# EAGLE design schematic (EAGLE 9.6.2)
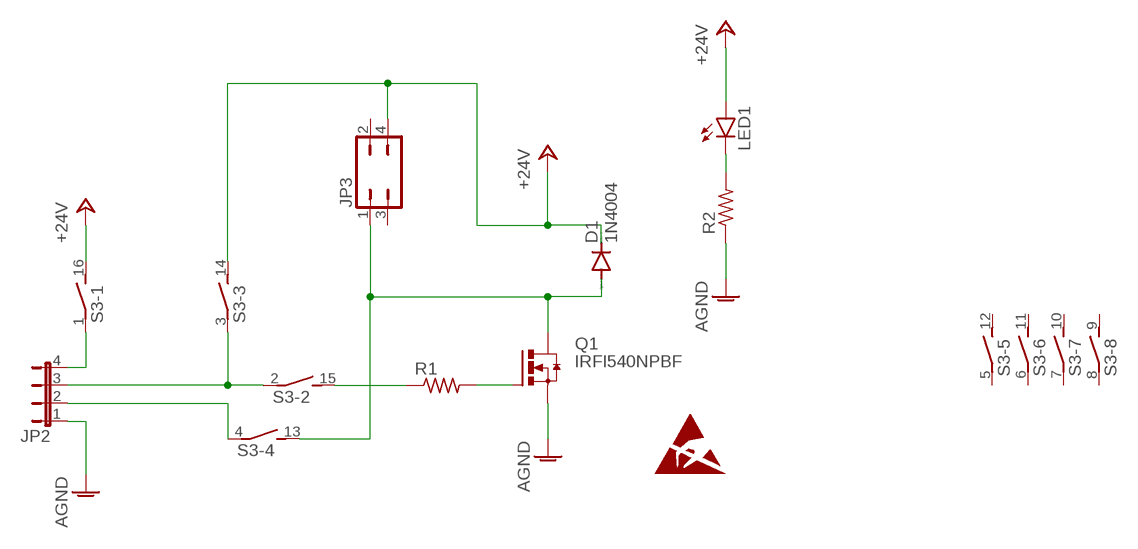
[diagram p0: schematic, sheet 1]

## Parts
D1  1N4004  [DO41-10]
JP2  JP4E  [JP4]
JP3  JP2Q  [JP2Q]
LED1  LED3MM  [LED3MM]
Q1  IRFI540NPBF  [TO220BH]
R1  R-US_M0805  [M0805]
R2  R-US_0411/15  [0411/15]
S3  DIP08S  [DIP08S]

## Nets
+24V: D1.C JP3.4 LED1.A S3.14 S3.16
AGND: JP2.1 Q1.S R2.1
N$1: Q1.G R1.2
N$2: D1.A JP3.1 Q1.D S3.13
N$3: JP2.3 S3.2 S3.3
N$4: JP2.4 S3.1
N$5: R1.1 S3.15
N$6: JP2.2 S3.4
N$7: LED1.K(C) R2.2
Unconnected: JP3.2 JP3.3 S3.5 S3.6 S3.7 S3.8 S3.9 S3.10 S3.11 S3.12

## Library data of the parts
D1 = diode:1N4004: DIODE general purpose rectifier, 1 A
JP2 = jumper:JP4E: JUMPER
JP3 = jumper:JP2Q: JUMPER
LED1 = led:LED: LED OSRAM: - CHIPLED LG R971, LG N971, LY N971, LG Q971, LY Q971, LO R971, LY R971 LH N974, LH R974 LS Q976, LO Q976, LY Q976 LO Q996 - Hyper CHIPLED LW Q18S LB Q993, LB Q99A, LB R99A - SideLED LS A670, LO A670, LY A670, LG A670, LP A670 LB A673, LV A673, LT A673, LW A673 LH A674 LY A675 LS A676, LA A676, LO A676, LY A676, LW A676 LS A679, LY A679, LG A679 - Hyper Micro SIDELED® LS Y876, LA Y876, LO Y876, LY Y876 LT Y87S - SmartLED LW L88C, LW L88S LB L89C, LB L89S, LG L890 LS L89K, LO L89K, LY L89K LS L896, LA L896, LO L896, LY L896 - TOPLED LS T670, LO T670, LY T670, LG T670, LP T670 LSG T670, LSP T670, LSY T670, LOP T670, LYG T670 LG T671, LOG T671, LSG T671 LB T673, LV T673, LT T673, LW T673 LH T674 LS T676, LA T676, LO T676, LY T676, LB T676, LH T676, LSB T676, LW T676 LB T67C, LV T67C, LT T67C, LS T67K, LO T67K, LY T67K, LW E67C LS E67B, LA E67B, LO E67B, LY E67B, LB E67C, LV E67C, LT E67C LW T67C LS T679, LY T679, LG T679 LS T770, LO T770, LY T770, LG T770, LP T770 LB T773, LV T773, LT T773, LW T773 LH T774 LS E675, LA E675, LY E675, LS T675 LS T776, LA T776, LO T776, LY T776, LB T776 LHGB T686 LT T68C, LB T68C - Hyper Mini TOPLED® LB M676 - Mini TOPLED Santana® LG M470 LS M47K, LO M47K, LY M47K Source: http://www.osram.convergy.de LUXEON: - LUMILED® LXK2-PW12-R00, LXK2-PW12-S00, LXK2-PW14-U00, LXK2-PW14-V00 LXK2-PM12-R00, LXK2-PM12-S00, LXK2-PM14-U00 LXK2-PE12-Q00, LXK2-PE12-R00, LXK2-PE12-S00, LXK2-PE14-T00, LXK2-PE14-U00 LXK2-PB12-K00, LXK2-PB12-L00, LXK2-PB12-M00, LXK2-PB14-N00, LXK2-PB14-P00, LXK2-PB14-Q00 LXK2-PR12-L00, LXK2-PR12-M00, LXK2-PR14-Q00, LXK2-PR14-R00 LXK2-PD12-Q00, LXK2-PD12-R00, LXK2-PD12-S00 LXK2-PH12-R00, LXK2-PH12-S00 LXK2-PL12-P00, LXK2-PL12-Q00, LXK2-PL12-R00 Source: www.luxeon.com KINGBRIGHT: KA-3528ASYC Source: www.kingbright.com
Q1 = transistor-power:IRFI540NPBF: HEXFET Power MOISFET VDSS = 100V, RDS(on) = 0.052 Ohm, ID = 20A, VGS(th) = 2.0 -- 4.0V Source: http://www.irf.com/product-info/datasheets/data/irfi540npbf.pdf
R1 R2 = rcl:R-US_: RESISTOR, American symbol; SPICEPREFIX: R
S3 = switch-dil:DIP08S: DIL/CODE SWITCH; OC_FARNELL: unknown; OC_NEWARK: unknown

## Board
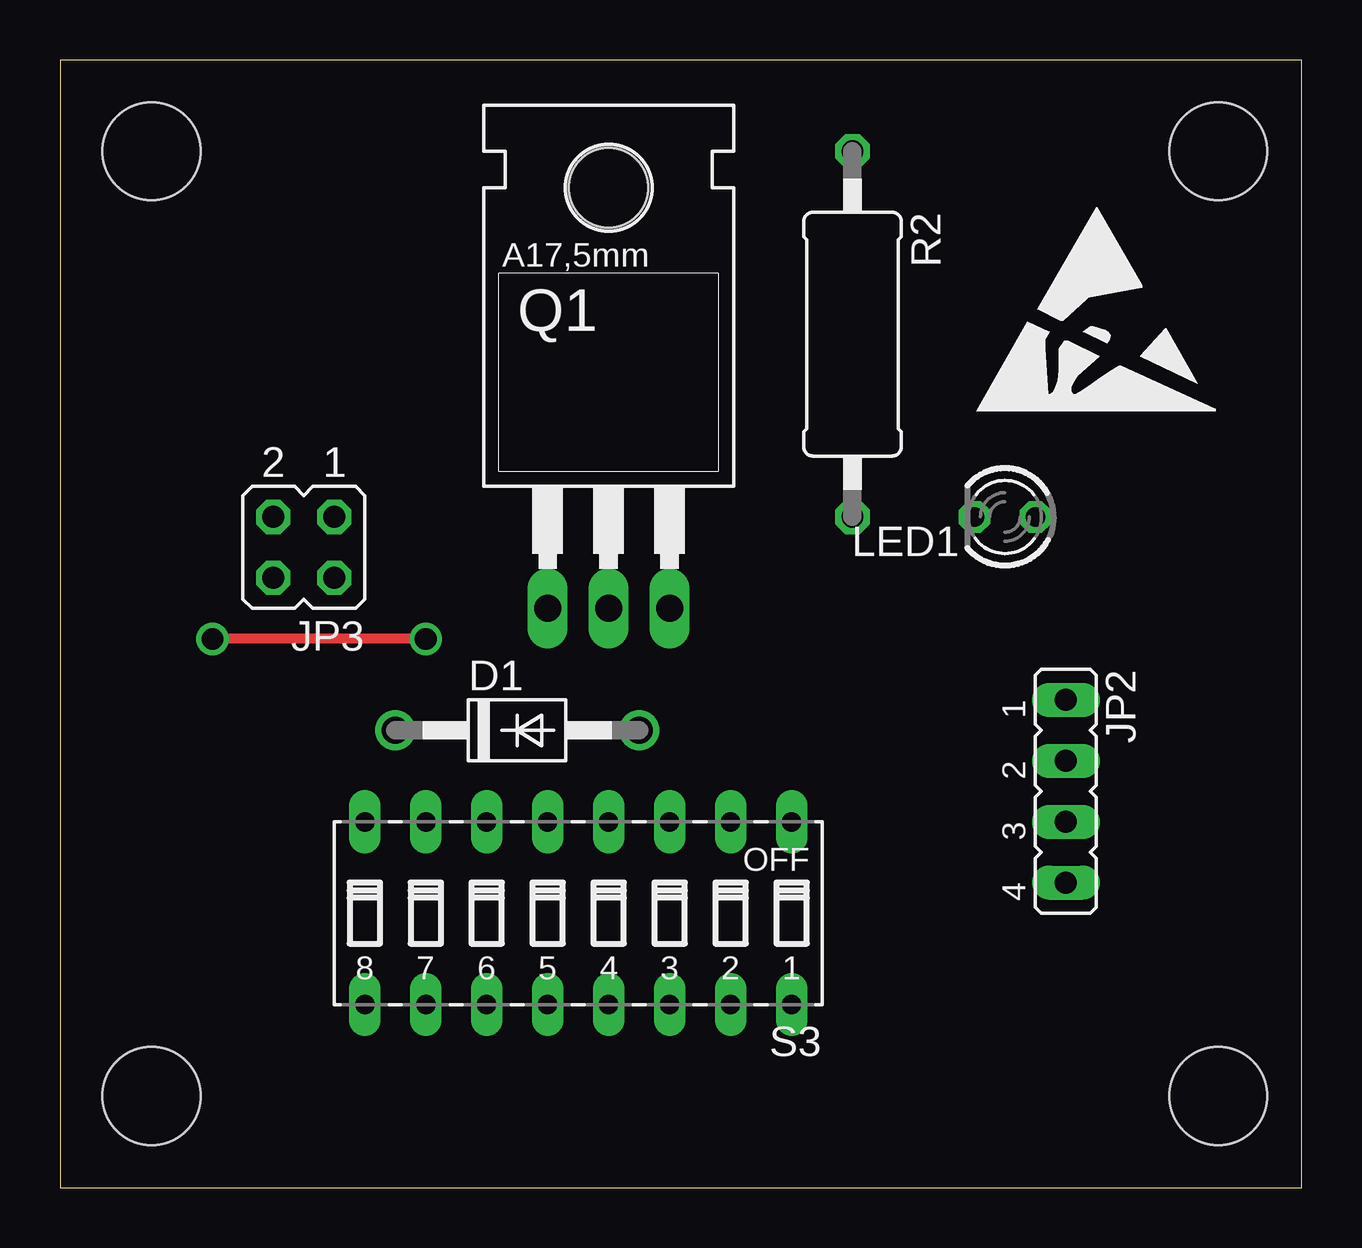
[diagram p1: board, top side]
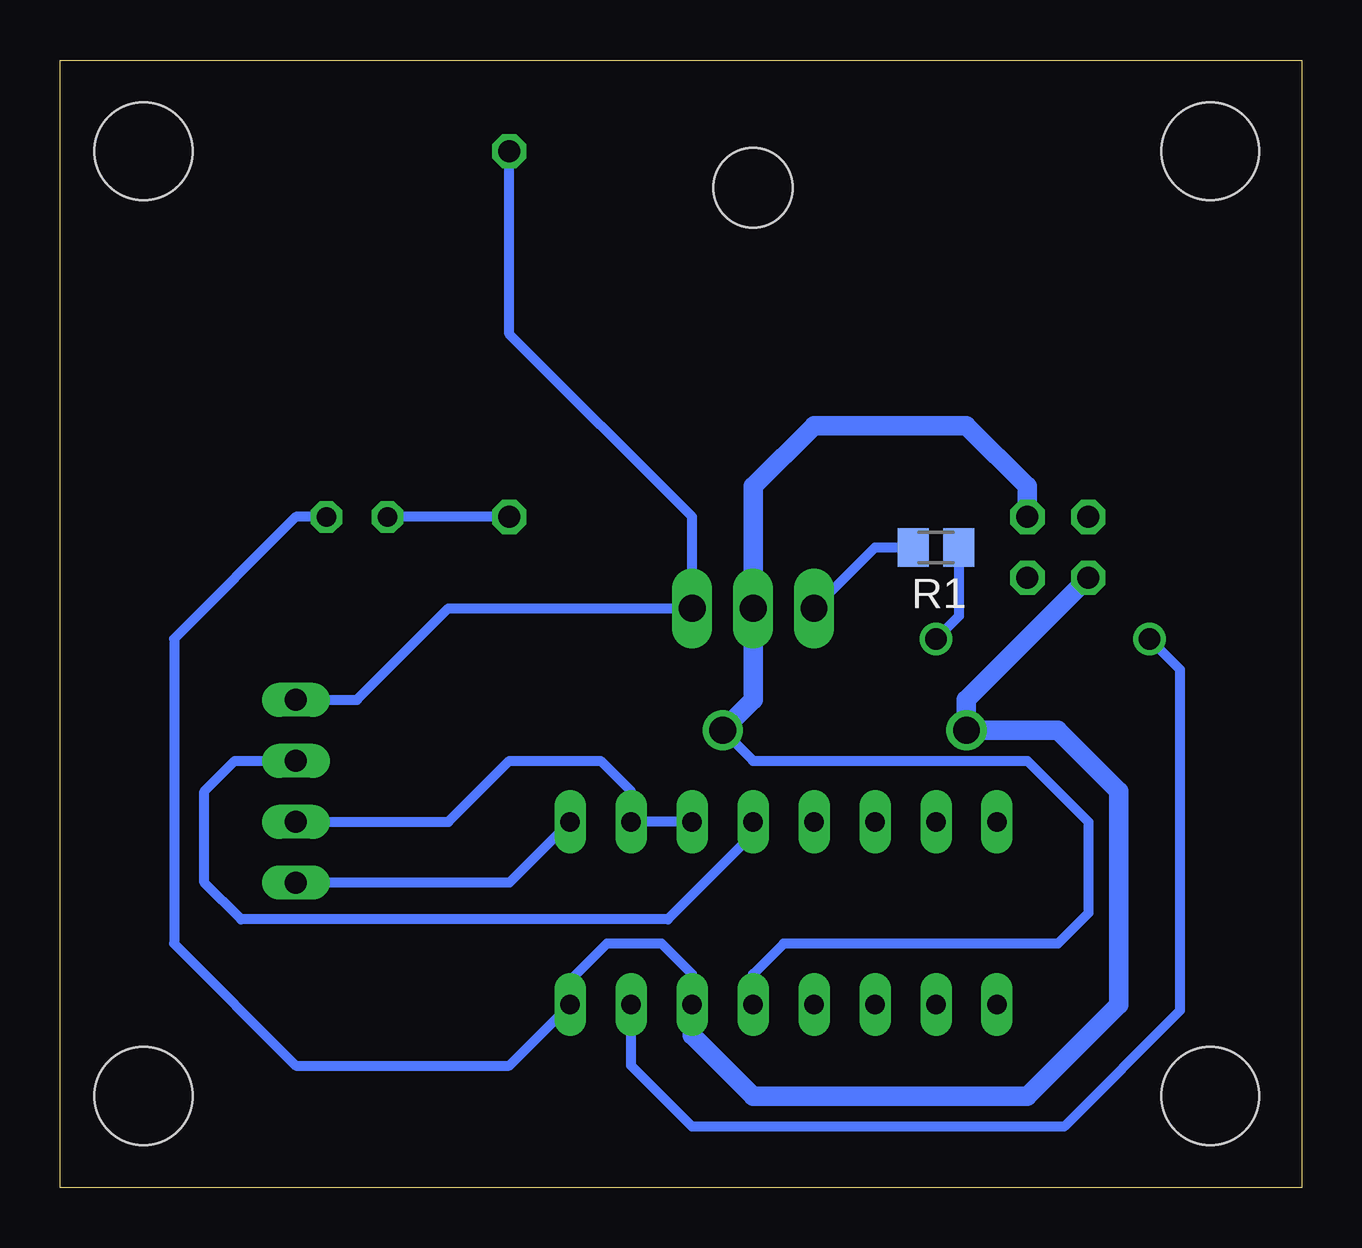
[diagram p2: board, bottom side, seen from below]

Size 51.74 x 46.98 mm. Coordinates in mm from the lower left corner, seen from the top.
Outline: 0,0 51.74,0 51.74,46.98 0,46.98 0,0
Copper layers (1*16): Top 0.035mm / dielectric 1.5mm / Bottom 0.035mm
Design rules "default": minimum track width 6mil, minimum drill 0.35mm, track to track 6mil, track to pad 6mil, pad to pad 6mil, via to via 6mil, smd to smd 6mil, copper to edge 40mil, drill to drill 6mil, minimum pad ring 10mil, minimum via ring 8mil, stop-mask expansion 4mil, vias tented up to drill 0mil, thermal gap 10mil
Holes 4.07 mm at 48.26,3.81 3.81,3.81 3.81,43.18 48.26,43.18

### Footprints (pad centres in the part's own frame; a part is rotated, then mirrored left to right if it is on the bottom)
DO41-10 = drill 1.118: A 5.08,0; C -5.08,0
JP4 = drill 0.914 long: 1 -3.81,0; 2 -1.27,0; 3 1.27,0; 4 3.81,0
JP2Q = drill 0.914 octagon: 1 -1.27,-1.27; 2 -1.27,1.27; 3 1.27,-1.27; 4 1.27,1.27
LED3MM = drill 0.813 octagon: A -1.27,0; K 1.27,0
TO220BH = drill 1.118 long: D 0,-6.35; G -2.54,-6.35; S 2.54,-6.35 | hole 3.302: 0,11.176
M0805 = smd 1.3 x 1.6: 1 -0.95,0; 2 0.95,0
0411/15 = drill 0.914 octagon: 1 -7.62,0; 2 7.62,0
DIP08S = drill 0.813 long: 1 -8.89,-3.81; 2 -6.35,-3.81; 3 -3.81,-3.81; 4 -1.27,-3.81; 5 1.27,-3.81; 6 3.81,-3.81; 7 6.35,-3.81; 8 8.89,-3.81; 9 8.89,3.81; 10 6.35,3.81; 11 3.81,3.81; 12 1.27,3.81; 13 -1.27,3.81; 14 -3.81,3.81; 15 -6.35,3.81; 16 -8.89,3.81

### Placement (x,y rotation side)
D1  19.05,19.05 0 top
JP2  41.91,16.51 270 top
JP3  10.16,26.67 180 top
LED1  39.37,27.94 180 top
Q1  22.86,30.48 0 top
R1  15.24,26.67 180 bottom
R2  33.02,35.56 270 top
S3  21.59,11.43 180 top
U$1  [ESD_10.00]  38.1,32.26 0 top

### Tracks (layer width: path | path; a pad name or v marks a point on that pad's centre or on a via)
+24V
  Bottom 0.406: LED1.A 41.91,27.94 46.99,22.86 46.99,10.16 41.91,5.08 33.02,5.08 S3.16 30.48,8.64 28.96,10.16 26.67,10.16 25.4,8.89 S3.14 25.4,6.35
  Bottom 0.813: JP3.4 13.97,20.32 D1.C 10.16,19.05 7.62,16.51 7.62,7.62 11.43,3.81 22.86,3.81 25.4,6.35
AGND
  Bottom 0.406: R2.1 33.02,35.56 25.4,27.94 Q1.S 35.56,24.13 39.37,20.32 JP2.1
N$1
  Bottom 0.406: Q1.G 17.78,26.67 R1.2
N$2
  Bottom 0.406: D1.A 22.86,17.78 11.43,17.78 8.89,15.24 8.89,11.43 10.16,10.16 21.59,10.16 22.86,8.89 S3.13
  Bottom 0.813: JP3.1 11.43,29.21 13.97,31.75 20.32,31.75 22.86,29.21 Q1.D 22.86,20.32 D1.A
N$3
  Bottom 0.406: JP2.3 35.56,15.24 33.02,17.78 29.21,17.78 27.94,16.51 S3.2 S3.3
N$4
  Bottom 0.406: JP2.4 33.02,12.7 S3.1
N$5  (via drill 0.9)
  Top 0.406: v15.24,22.86 v6.35,22.86
  Bottom 0.406: R1.1 14.29,23.81 v15.24,22.86 | v6.35,22.86 5.08,21.59 5.08,7.37 9.91,2.54 25.4,2.54 27.94,5.08 S3.15
N$6
  Bottom 0.406: S3.4 22.86,14.73 26.42,11.18 44.2,11.18 45.72,12.7 45.72,16.51 44.45,17.78 JP2.2
N$7
  Bottom 0.406: R2.2 LED1.K